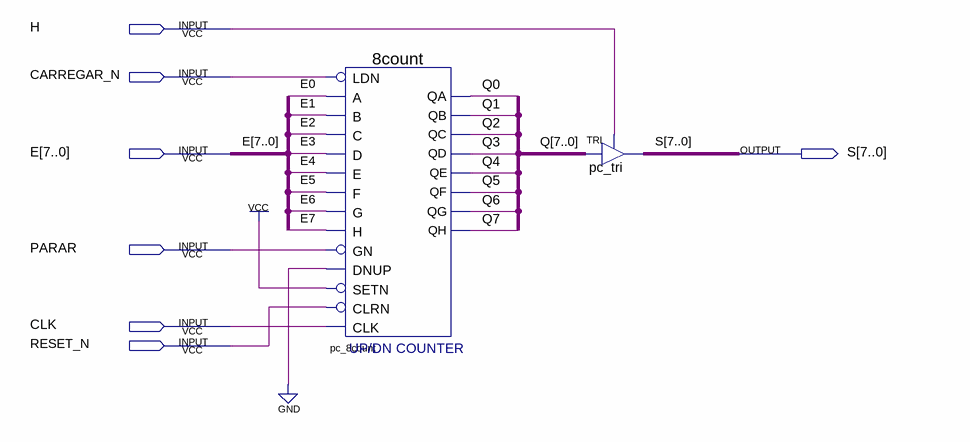
[diagram p0: schematic sheet]
// Quartus schematic PC_ContadorDePrograma.bdf as structural Verilog: 2 symbols, 7 pins
module PC_ContadorDePrograma (
  input  H,
  input  CARREGAR_N,
  input  [7:0] E,
  input  PARAR,
  input  CLK,
  input  RESET_N,
  output [7:0] S
);

  wire [7:0] Q;

  \8count  pc_8count (
    .B(E[1]), .A(E[0]), .LDN(CARREGAR_N), .D(E[3]), .C(E[2]), .E(E[4]), .F(E[5]), .GN(PARAR), .H(E[7]),
    .G(E[6]), .CLRN(RESET_N), .SETN(1'b1), .DNUP(1'b0), .CLK(CLK), .QB(Q[1]), .QA(Q[0]), .QE(Q[4]),
    .QD(Q[3]), .QC(Q[2]), .QH(Q[7]), .QG(Q[6]), .QF(Q[5]));
  TRI pc_tri[7:0] (.IN(Q), .OE(H), .OUT(S));
endmodule
